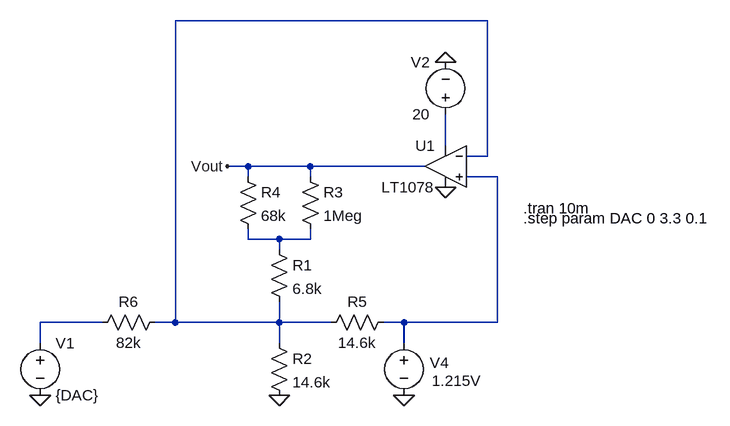
[diagram p0: schematic sim_MPPTX_Output-Voltage.asc]
sim_MPPTX_Output-Voltage.asc, the LTspice schematic file:
Version 4
SHEET 1 880 680
WIRE 288 -224 -192 -224
WIRE 224 -32 224 -80
WIRE 288 -16 288 -224
WIRE 288 -16 256 -16
WIRE -80 0 -112 0
WIRE 16 0 -80 0
WIRE 192 0 16 0
WIRE -80 16 -80 0
WIRE 16 16 16 0
WIRE 304 16 256 16
WIRE -80 112 -80 96
WIRE -32 112 -80 112
WIRE 16 112 16 96
WIRE 16 112 -32 112
WIRE -32 128 -32 112
WIRE -304 240 -400 240
WIRE -192 240 -192 -224
WIRE -192 240 -224 240
WIRE -32 240 -32 208
WIRE -32 240 -192 240
WIRE 48 240 -32 240
WIRE 160 240 128 240
WIRE 304 240 304 16
WIRE 304 240 160 240
WIRE -400 272 -400 240
WIRE -32 272 -32 240
WIRE 160 272 160 240
FLAG 224 -160 0
FLAG 224 32 0
FLAG 160 352 0
FLAG -32 352 0
FLAG -400 352 0
FLAG -112 0 Vout
SYMBOL res -48 112 R0
SYMATTR InstName R1
SYMATTR Value 6.8k
SYMBOL res 0 0 R0
SYMATTR InstName R3
SYMATTR Value 1Meg
SYMBOL Opamps\\LT1078 224 -64 M0
SYMATTR InstName U1
SYMBOL voltage 224 -64 R180
WINDOW 0 24 96 Left 2
WINDOW 3 24 16 Left 2
WINDOW 123 0 0 Left 2
WINDOW 39 0 0 Left 2
SYMATTR InstName V2
SYMATTR Value 20
SYMBOL voltage 160 256 R0
WINDOW 0 40 46 Left 2
WINDOW 3 43 74 Left 2
WINDOW 123 0 0 Left 2
WINDOW 39 0 0 Left 2
SYMATTR InstName V4
SYMATTR Value 1.215V
SYMBOL res -96 0 R0
SYMATTR InstName R4
SYMATTR Value 68k
SYMBOL res -48 256 R0
SYMATTR InstName R2
SYMATTR Value 14.6k
SYMBOL res 32 256 R270
WINDOW 0 32 56 VTop 2
WINDOW 3 0 56 VBottom 2
SYMATTR InstName R5
SYMATTR Value 14.6k
SYMBOL voltage -400 256 R0
WINDOW 123 0 0 Left 2
WINDOW 39 0 0 Left 2
SYMATTR InstName V1
SYMATTR Value {DAC}
SYMBOL res -208 224 R90
WINDOW 0 0 56 VBottom 2
WINDOW 3 32 56 VTop 2
SYMATTR InstName R6
SYMATTR Value 82k
TEXT 344 64 Left 2 !.tran 10m
TEXT 344 80 Left 2 !.step param DAC 0 3.3 0.1

The netlist it stands for:
* sim_MPPTX_Output-Voltage.asc
R1 N004 N001 6.8k
R3 Vout N004 1Meg
XU1 N003 N001 N002 0 Vout LT1078  ; pins In+ In- V+ V- OUT
V2 N002 0 20
V4 N003 0 1.215V
R4 Vout N004 68k
R2 N001 0 14.6k
R5 N001 N003 14.6k
V1 N005 0 {DAC}
R6 N001 N005 82k
.tran 10m
.step param DAC 0 3.3 0.1
.backanno
.end